# EAGLE design lmp9100 (EAGLE 7.2.0)
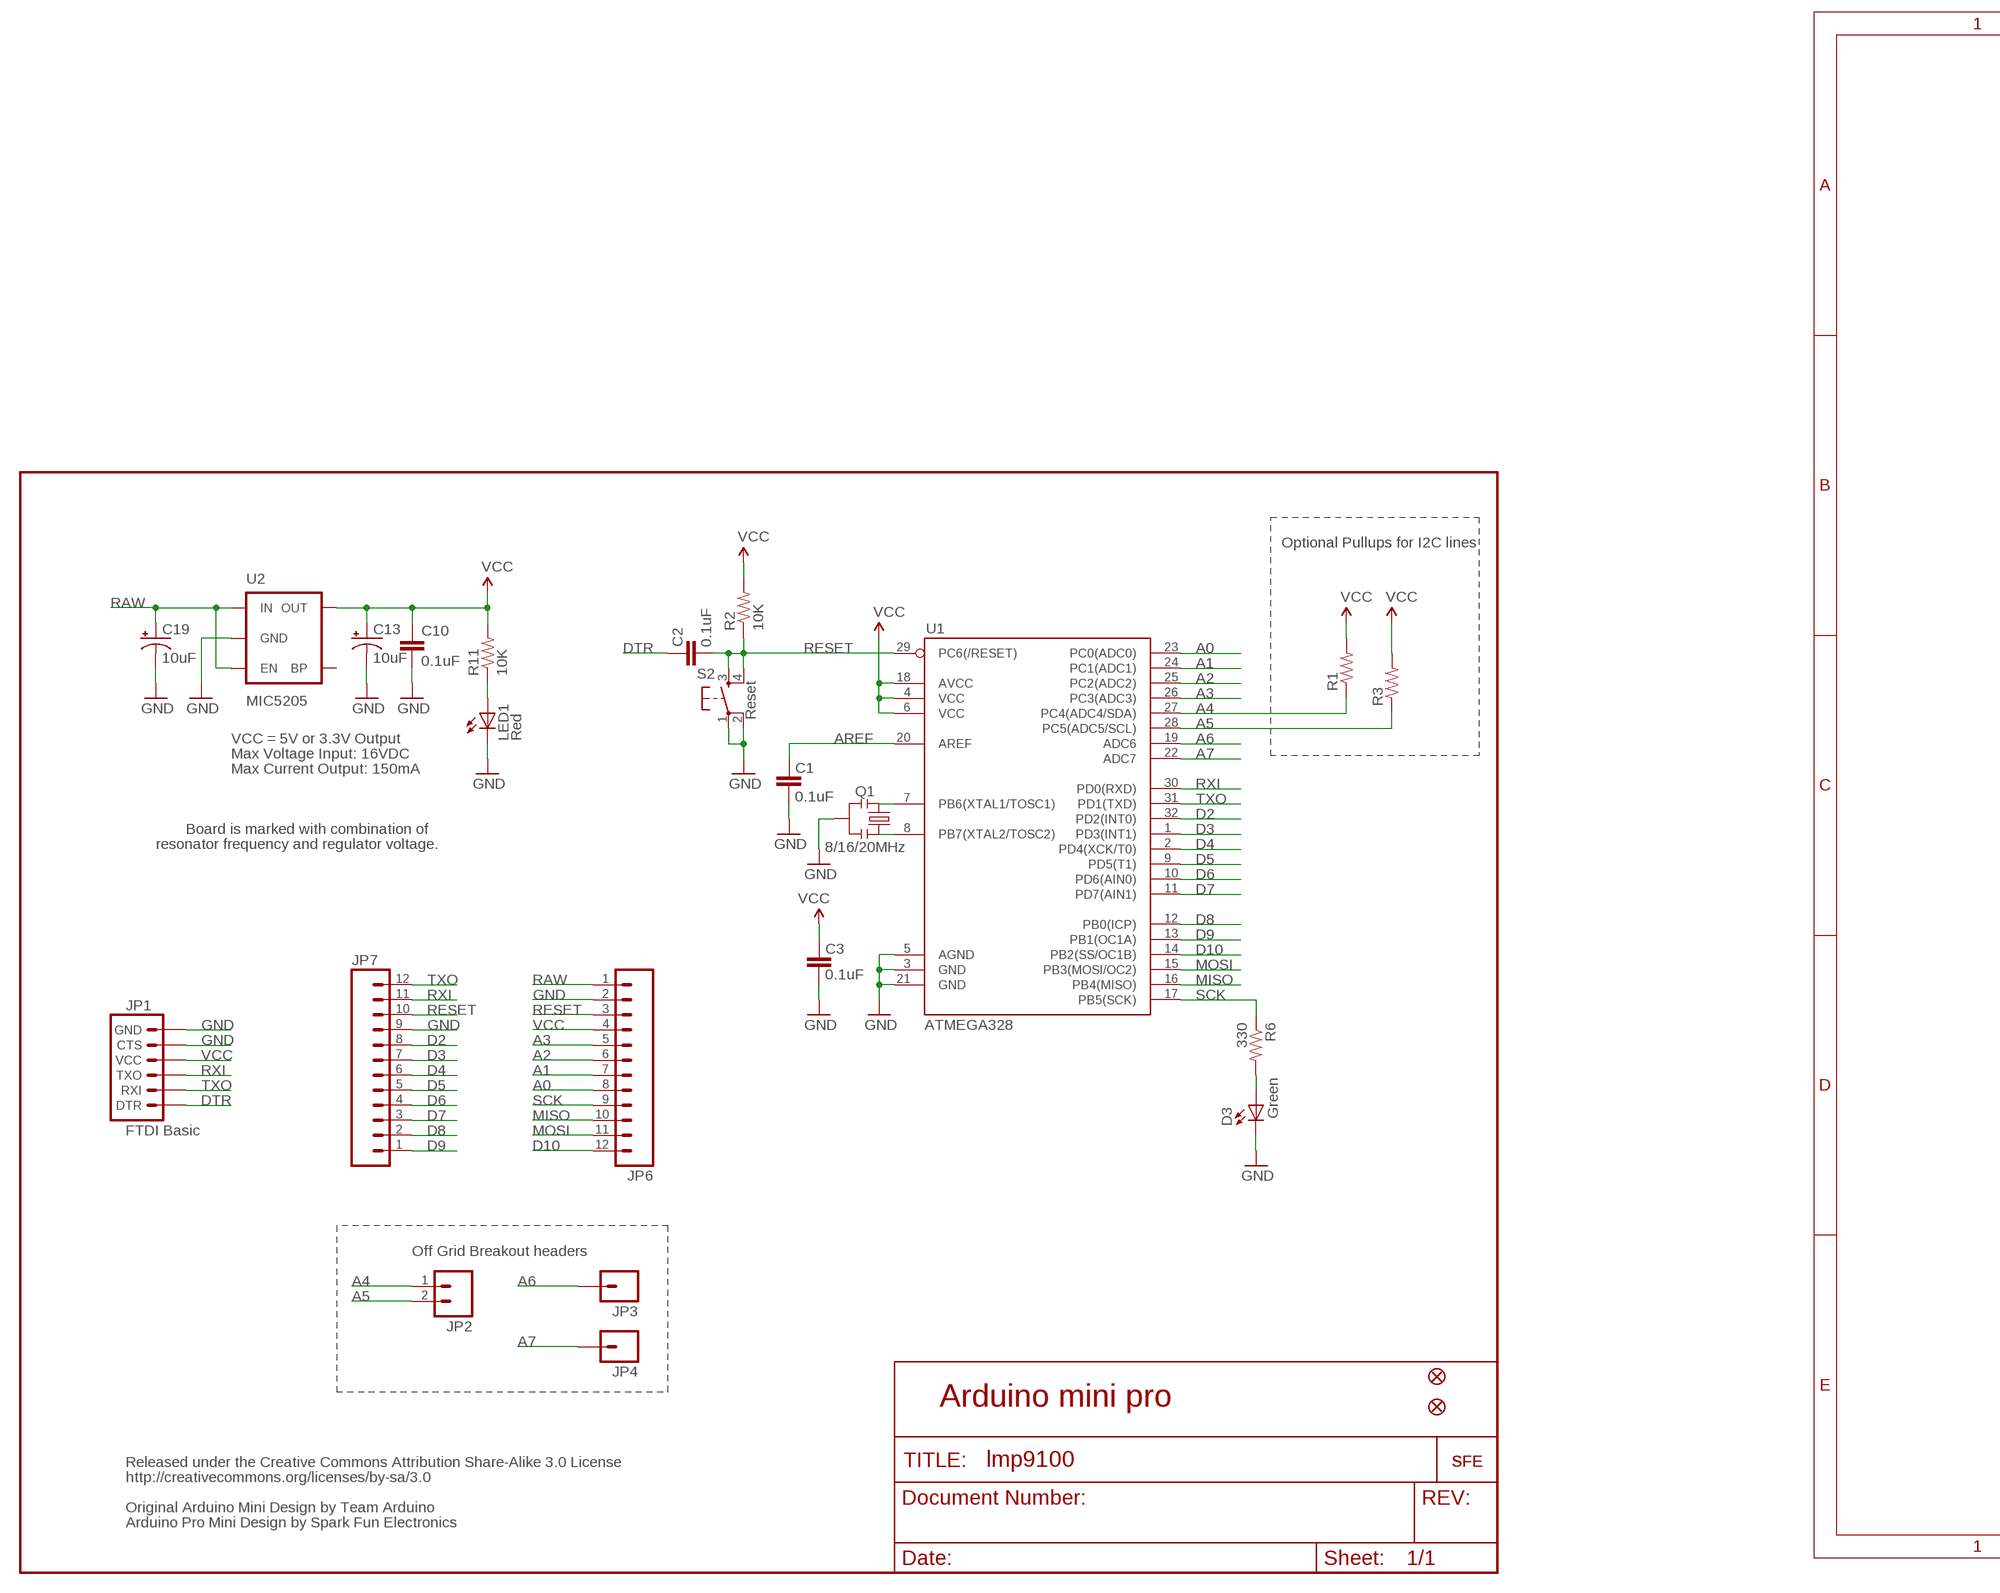
[diagram p0: schematic, sheet 1, part 1 of 2]
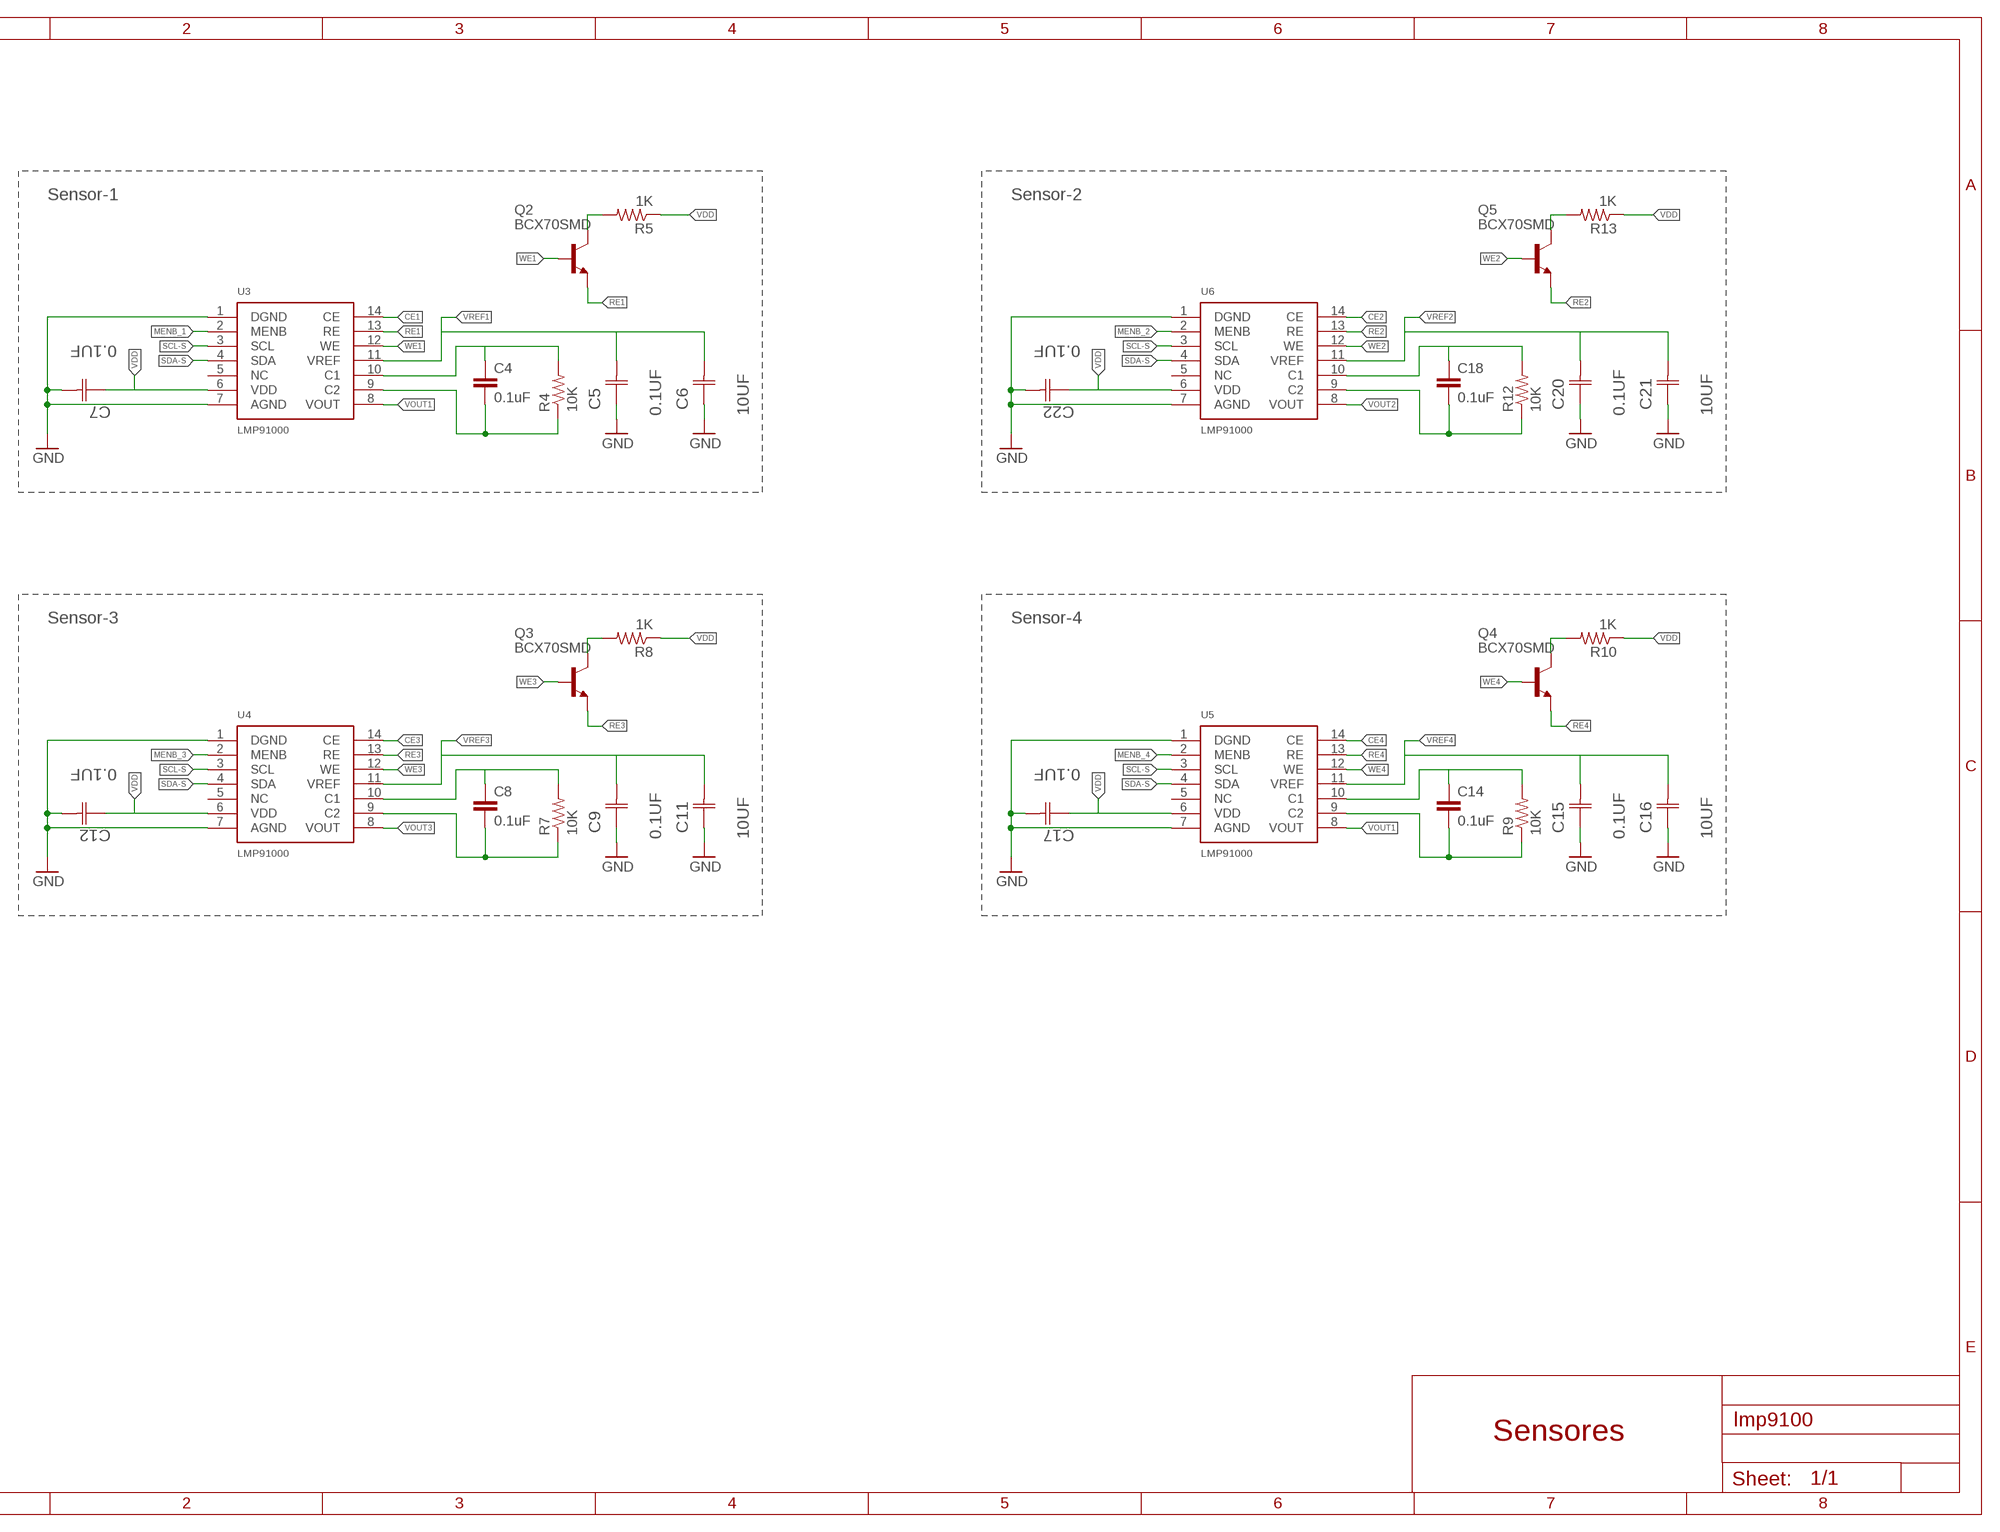
[diagram p1: schematic, sheet 1, part 2 of 2]

## Parts
C1  0.1uF  CAP0402-CAP  [0402-CAP]
C2  0.1uF  CAP0402-CAP  [0402-CAP]
C3  0.1uF  CAP0402-CAP  [0402-CAP]
C4  0.1uF  CAP0402-CAP  [0402-CAP]
C5  0.1UF  0603YC104KAT2A  [CAPC1608X90N]
C6  10UF  1206YD106MAT2A  [CAPC3216X178N]
C7  0.1UF  0603YC104KAT2A  [CAPC1608X90N]
C8  0.1uF  CAP0402-CAP  [0402-CAP]
C9  0.1UF  0603YC104KAT2A  [CAPC1608X90N]
C10  0.1uF  CAP0402-CAP  [0402-CAP]
C11  10UF  1206YD106MAT2A  [CAPC3216X178N]
C12  0.1UF  0603YC104KAT2A  [CAPC1608X90N]
C13  10uF  CAP_POL1206  [EIA3216]
C14  0.1uF  CAP0402-CAP  [0402-CAP]
C15  0.1UF  0603YC104KAT2A  [CAPC1608X90N]
C16  10UF  1206YD106MAT2A  [CAPC3216X178N]
C17  0.1UF  0603YC104KAT2A  [CAPC1608X90N]
C18  0.1uF  CAP0402-CAP  [0402-CAP]
C19  10uF  CAP_POL1206  [EIA3216]
C20  0.1UF  0603YC104KAT2A  [CAPC1608X90N]
C21  10UF  1206YD106MAT2A  [CAPC3216X178N]
C22  0.1UF  0603YC104KAT2A  [CAPC1608X90N]
D3  Green  LED0603  [LED-0603]
JP1  FTDI Basic  ARDUINO_SERIAL_PROGRAMPTH  [1X06]
JP2  M02PTH  [1X02]
JP3  M01PTH  [1X01]
JP4  M01PTH  [1X01]
JP5  FIDUCIALUFIDUCIAL  [MICRO-FIDUCIAL]
JP6  M12PTH  [1X12]
JP7  M12PTH  [1X12]
JP8  FIDUCIALUFIDUCIAL  [MICRO-FIDUCIAL]
LED1  Red  LED0603  [LED-0603]
Q1  8/16/20MHz  RESONATORSMD  [RESONATOR-SMD]
Q2  BCX70SMD  [SOT23]
Q3  BCX70SMD  [SOT23]
Q4  BCX70SMD  [SOT23]
Q5  BCX70SMD  [SOT23]
R1  RESISTOR0402-RES  [0402-RES]
R2  10K  RESISTOR0402-RES  [0402-RES]
R3  RESISTOR0402-RES  [0402-RES]
R4  10K  RESISTOR0402-RES  [0402-RES]
R5  1K  RESISTOR0402-RES  [0402-RES]
R6  330  RESISTOR0402-RES  [0402-RES]
R7  10K  RESISTOR0402-RES  [0402-RES]
R8  1K  RESISTOR0402-RES  [0402-RES]
R9  10K  RESISTOR0402-RES  [0402-RES]
R10  1K  RESISTOR0402-RES  [0402-RES]
R11  10K  RESISTOR0402-RES  [0402-RES]
R12  10K  RESISTOR0402-RES  [0402-RES]
R13  1K  RESISTOR0402-RES  [0402-RES]
S2  Reset  TAC_SWITCHSMD  [TACTILE_SWITCH_SMD]
U1  ATMEGA328  ATMEGA168  [TQFP32-08]
U2  MIC5205  V_REG_LDOSMD  [SOT23-5]
U3  LMP91000  [LMP91000]
U4  LMP91000  [LMP91000]
U5  LMP91000  [LMP91000]
U6  LMP91000  [LMP91000]
U$1  LOGO-SFESK  [SFE-LOGO-FLAME]
U$11  LOGO-SFENEW  [SFE-NEW-WEBLOGO]

## Nets
A0: JP6.8 U1.23(PC0(ADC0))
A1: JP6.7 U1.24(PC1(ADC1))
A2: JP6.6 U1.25(PC2(ADC2))
A3: JP6.5 U1.26(PC3(ADC3))
A4: JP2.1 R1.1 U1.27(PC4(ADC4/SDA))
A5: JP2.2 R3.1 U1.28(PC5(ADC5/SCL))
A6: JP3.1 U1.19(ADC6)
A7: JP4.1 U1.22(ADC7)
AREF: C1.2 U1.20(AREF)
CE1: U3.14(CE)
CE2: U6.14(CE)
CE3: U4.14(CE)
CE4: U5.14(CE)
D2: JP7.8 U1.32(PD2(INT0))
D3: JP7.7 U1.1(PD3(INT1))
D4: JP7.6 U1.2(PD4(XCK/T0))
D5: JP7.5 U1.9(PD5(T1))
D6: JP7.4 U1.10(PD6(AIN0))
D7: JP7.3 U1.11(PD7(AIN1))
D8: JP7.2 U1.12(PB0(ICP))
D9: JP7.1 U1.13(PB1(OC1A))
D10: JP6.12 U1.14(PB2(SS/OC1B))
DTR: C2.2 JP1.1(DTR)
GND [vcc]: C1.1 C3.1 C5.1(C1) C6.1(C1) C7.2(C2) C9.1(C1) C10.2 C11.1(C1) C12.2(C2) C13.C(-) C15.1(C1) C16.1(C1) C17.2(C2) C19.C(-) C20.1(C1) C21.1(C1) C22.2(C2) D3.C JP1.5(CTS) JP1.6(GND) JP6.2 JP7.9 LED1.C Q1.2 S2.1 S2.2 U1.3(GND) U1.5(AGND) U1.21(GND) U2.2(GND) U3.1(DGND) U3.7(AGND) U4.1(DGND) U4.7(AGND) U5.1(DGND) U5.7(AGND) U6.1(DGND) U6.7(AGND)
MENB_1: U3.2(MENB)
MENB_2: U6.2(MENB)
MENB_3: U4.2(MENB)
MENB_4: U5.2(MENB)
MISO: JP6.10 U1.16(PB4(MISO))
MOSI: JP6.11 U1.15(PB3(MOSI/OC2))
N$1: Q1.1 U1.8(PB7(XTAL2/TOSC2))
N$2: Q1.3 U1.7(PB6(XTAL1/TOSC1))
N$3: C4.2 R4.1 U3.9(C2)
N$4: C4.1 R4.2 U3.10(C1)
N$5: Q2.3(C) R5.2
N$6: C8.2 R7.1 U4.9(C2)
N$7: D3.A R6.2
N$8: C8.1 R7.2 U4.10(C1)
N$9: Q3.3(C) R8.2
N$10: C14.2 R9.1 U5.9(C2)
N$11: C14.1 R9.2 U5.10(C1)
N$12: Q4.3(C) R10.2
N$13: C18.2 R12.1 U6.9(C2)
N$14: C18.1 R12.2 U6.10(C1)
N$15: Q5.3(C) R13.2
N$38: LED1.A R11.1
RAW [vcc]: C19.A(+) JP6.1 U2.1(IN) U2.3(EN)
RE1: Q2.2(E) U3.13(RE)
RE2: Q5.2(E) U6.13(RE)
RE3: Q3.2(E) U4.13(RE)
RE4: Q4.2(E) U5.13(RE)
RESET: C2.1 JP6.3 JP7.10 R2.1 S2.3 S2.4 U1.29(PC6(/RESET))
RXI: JP1.3(TXO) JP7.11 U1.30(PD0(RXD))
SCK: JP6.9 R6.1 U1.17(PB5(SCK))
SCL-S: U3.3(SCL) U4.3(SCL) U5.3(SCL) U6.3(SCL)
SDA-S: U3.4(SDA) U4.4(SDA) U5.4(SDA) U6.4(SDA)
TXO: JP1.2(RXI) JP7.12 U1.31(PD1(TXD))
VCC: C3.2 C10.1 C13.A(+) JP1.4(VCC) JP6.4 R1.2 R2.2 R3.2 R11.2 U1.4(VCC) U1.6(VCC) U1.18(AVCC) U2.5(OUT)
VDD: C7.1(C1) C12.1(C1) C17.1(C1) C22.1(C1) R5.1 R8.1 R10.1 R13.1 U3.6(VDD) U4.6(VDD) U5.6(VDD) U6.6(VDD)
VOUT1: U3.8(VOUT) U5.8(VOUT)
VOUT2: U6.8(VOUT)
VOUT3: U4.8(VOUT)
VREF1: C5.2(C2) C6.2(C2) U3.11(VREF)
VREF2: C20.2(C2) C21.2(C2) U6.11(VREF)
VREF3: C9.2(C2) C11.2(C2) U4.11(VREF)
VREF4: C15.2(C2) C16.2(C2) U5.11(VREF)
WE1: Q2.1(B) U3.12(WE)
WE2: Q5.1(B) U6.12(WE)
WE3: Q3.1(B) U4.12(WE)
WE4: Q4.1(B) U5.12(WE)
Unconnected: U2.4(BP) U3.5(NC) U4.5(NC) U5.5(NC) U6.5(NC)

## Notes on the sheet
- Sensor-1 | Sensor-2
- Optional Pullups for I2C lines
- Sensor-3 | Sensor-4
- VCC = 5V or 3.3V Output
- Max Voltage Input: 16VDC
- Max Current Output: 150mA
- Board is marked with combination of
- resonator frequency and regulator voltage.
- Off Grid Breakout headers
- Arduino mini pro
- Released under the Creative Commons Attribution Share-Alike 3.0 License
- http://creativecommons.org/licenses/by-sa/3.0 | Sensores
- Original Arduino Mini Design by Team Arduino
- Arduino Pro Mini Design by Spark Fun Electronics

## Library data of the parts
C1-C4 C8 C10 C14 C18 = SparkFun:CAP: Capacitor Standard 0603 ceramic capacitor, and 0.1" leaded capacitor.
C5 C7 C9 C12 C15 C17 C20 C22 = AVX_By_element14_Batch_1:0603YC104KAT2A: Capacitor, 0603; MPN: 0603YC104KAT2A; OC_FARNELL: 1327679; OC_NEWARK: 96M1176; SUPPLIER: AVX; TOLERANCE: ±10%; VOLTAGERATING: 16V
C6 C11 C16 C21 = AVX_By_element14_Batch_1:1206YD106MAT2A: Capacitor 1206; MPN: 1206YD106MAT2A; OC_FARNELL: 1582746; OC_NEWARK: 96M1430; SUPPLIER: AVX; TOLERANCE: ±20%; VOLTAGERATING: 16V
C13 C19 = SparkFun:CAP_POL: Capacitor Polarized These are standard SMD and PTH capacitors. Normally 10uF, 47uF, and 100uF in electrolytic and tantalum varieties. Always verify the external diameter of the through hole cap, it varies with capacity, voltage, and manufacturer. The EIA devices should be standard.
D3 LED1 = SparkFun:LED: LEDs Standard schematic elements and footprints for 5mm, 3mm, 1206, and 0603 sized LEDs. 5mm - Spark Fun Electronics SKU : COM-00529 (and others)
JP1 = SparkFun:ARDUINO_SERIAL_PROGRAM
JP2 = SparkFun:M02: Header 2 Standard 2-pin 0.1" header. Use with straight break away headers (SKU : PRT-00116), right angle break away headers (PRT-00553), swiss pins (PRT-00743), machine pins (PRT-00117), and female headers (PRT-00115). Molex polarized connector foot print use with SKU : PRT-08233 with associated crimp pins and housings.
JP3 JP4 = SparkFun:M01: Header 1 Standard 1-pin 0.1" header. Use with straight break away headers (SKU : PRT-00116), right angle break away headers (PRT-00553), swiss pins (PRT-00743), machine pins (PRT-00117), and female headers (PRT-00115).
JP5 JP8 = SparkFun:FIDUCIAL: Fiducial Alignment Points Various fiducial points for machine vision alignment.
JP6 JP7 = SparkFun:M12: Header 12 Standard 12-pin 0.1" header. Use with straight break away headers (SKU : PRT-00116), right angle break away headers (PRT-00553), swiss pins (PRT-00743), machine pins (PRT-00117), and female headers (PRT-00115).
Q1 = SparkFun:RESONATOR: Resonator Small SMD resonator. This is the itty bitty 10/20MHz resonators with built in caps. CSTCE10M0G55 and CSTCE20M0V53. Footprint has been reviewed closely but hasn't been tested yet.
Q2-Q5 = transistor-npn:BCX70*: NPN Transistor
R1-R13 = SparkFun:RESISTOR: Resistor Basic schematic elements and footprints for 0603, 1206, and PTH resistors.
S2 = SparkFun:TAC_SWITCH: Momentary Switch Button commonly used for reset or general input. Spark Fun Electronics SKU : COM-00097
U1 = SparkFun:ATMEGA168
U2 = SparkFun:V_REG_LDO: Voltage Regulator LDO Standard 150mA LDO voltage regulator in SOT-23 layout. Micrel part MIC5205. BP (by-pass) pin is used to lower output noise with 470pF cap.
U3-U6 = lmp91000:LMP91000
U$1 U$11 = SparkFun:LOGO-SFE: Spark Fun Electronics PCB Logo This is the standard Spark Fun Electronics PCB logo.

## Net classes
0 default: width 0.203 mm
1 vcc: width 0.254 mm

## Board
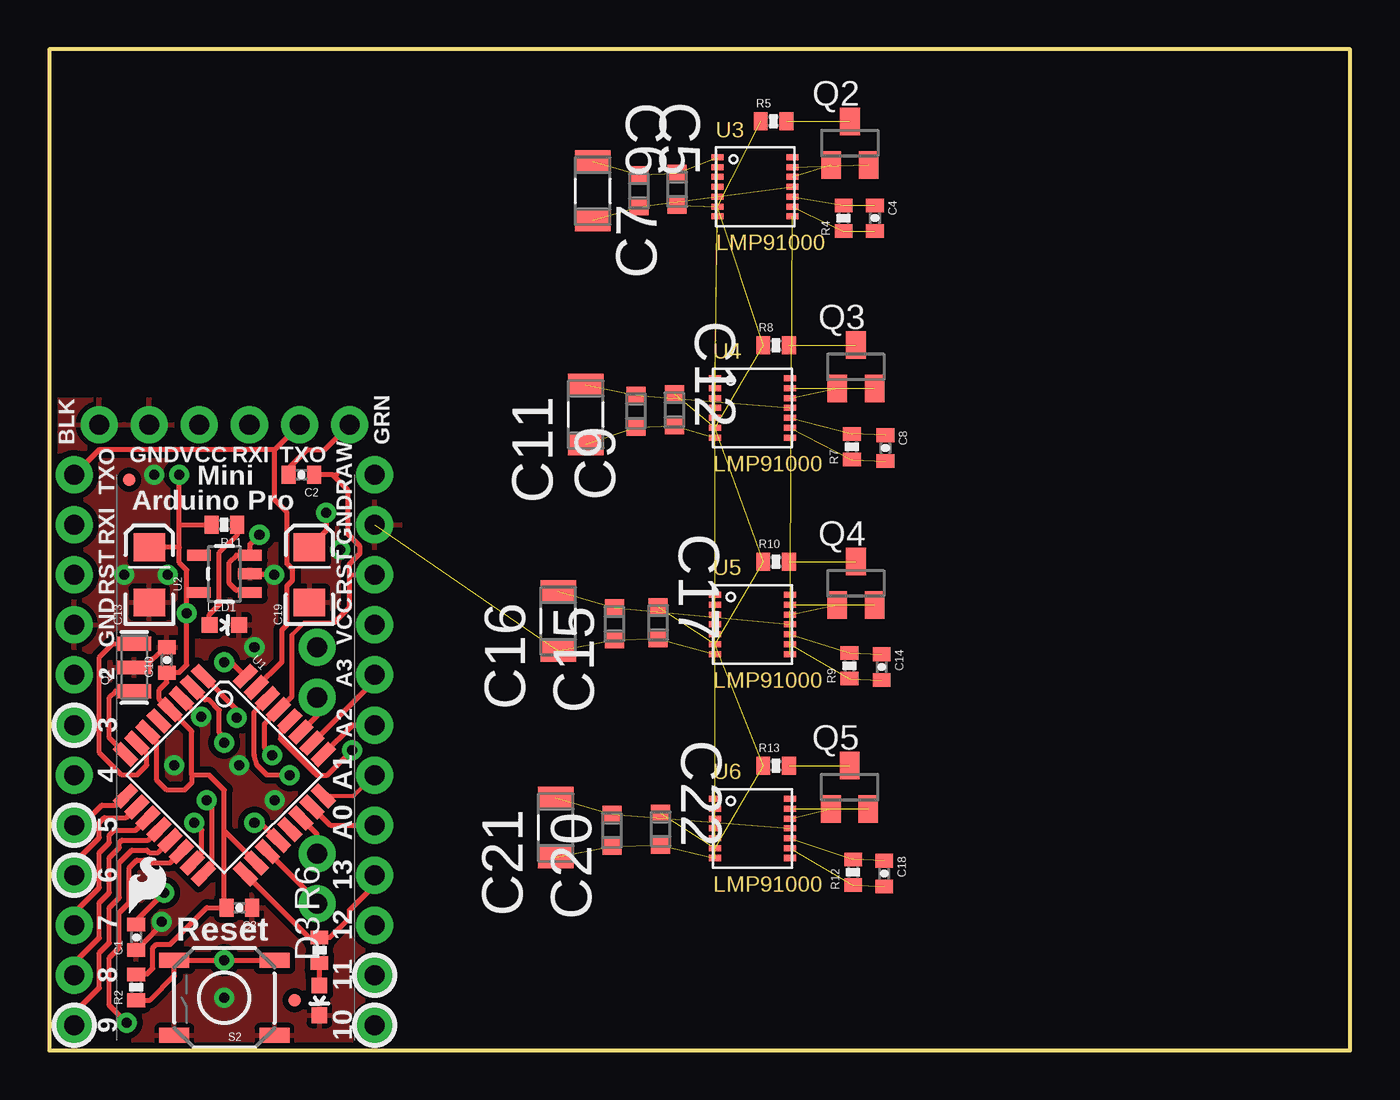
[diagram p2: board, top side]
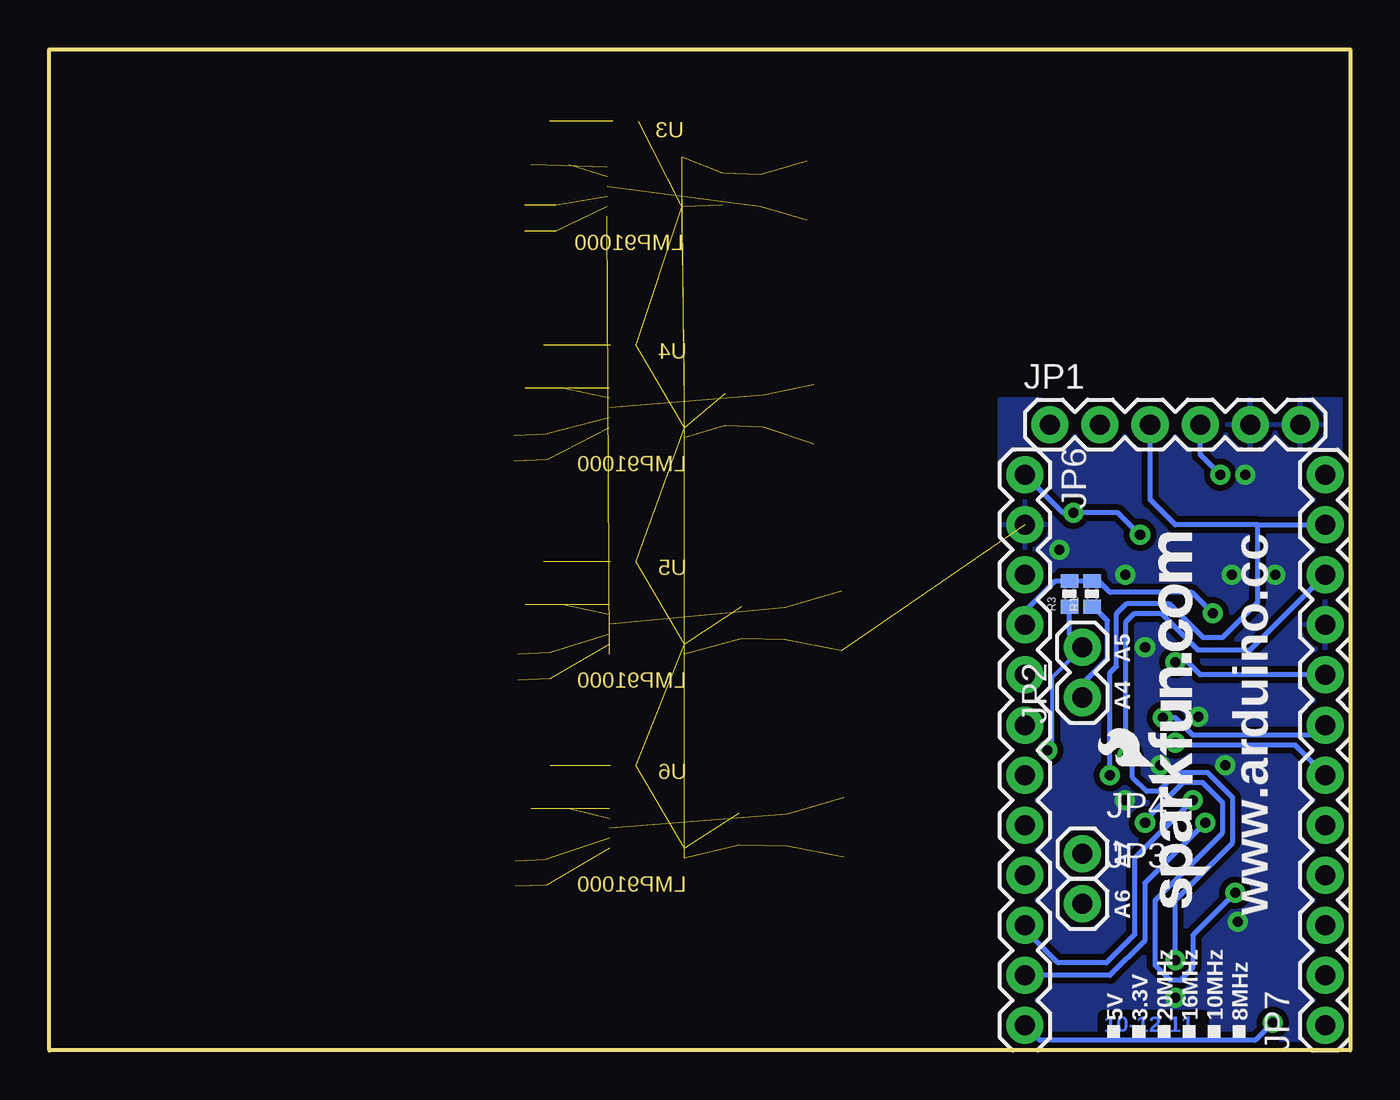
[diagram p3: board, bottom side, seen from below]

Size 66.04 x 50.8 mm. Coordinates in mm from the lower left corner, seen from the top.
Outline: 0,50.8 0,0 66.04,0 66.04,50.8 0,50.8
Copper layers (1*16): Top 0.035mm / dielectric 1.5mm / Bottom 0.035mm
Design rules "default": minimum track width 8mil, minimum drill 20mil, track to track 8mil, track to pad 8mil, pad to pad 8mil, via to via 8mil, smd to smd 8mil, copper to edge 8mil, drill to drill 8mil, minimum pad ring 12mil, minimum via ring 10mil, stop-mask expansion 4mil, vias tented up to drill 20mil, thermal gap 10mil

### Footprints (pad centres in the part's own frame; a part is rotated, then mirrored left to right if it is on the bottom)
0402-CAP = smd 0.7 x 0.9: 1 -0.65,0; 2 0.65,0
CAPC1608X90N = smd 0.864 x 0.965: 1 -0.813,0; 2 0.813,0
CAPC3216X178N = smd 1.118 x 1.803: 1 -1.499,0; 2 1.499,0
EIA3216 = smd 1.4 x 1.6: A 1.4,0; C -1.4,0
LED-0603 = smd 0.8 x 0.8: A 0,-0.75; C 0,0.75
1X06 = drill 1.016 pad 1.88: 1 0,0; 2 2.54,0; 3 5.08,0; 4 7.62,0; 5 10.16,0; 6 12.7,0
1X02 = drill 1.016 pad 1.88: 1 0,0; 2 2.54,0
1X01 = drill 1.016 pad 1.88: 1 0,0
MICRO-FIDUCIAL = smd 0.635 x 0.635: 1 0,0
1X12 = drill 1.016 pad 1.88: 1 0,0; 2 2.54,0; 3 5.08,0; 4 7.62,0; 5 10.16,0; 6 12.7,0; 7 15.24,0; 8 17.78,0; 9 20.32,0; 10 22.86,0; 11 25.4,0; 12 27.94,0
RESONATOR-SMD = smd 0.7 x 1.7: 1 -1.2,0; 2 0,0; 3 1.2,0
SOT23 = smd 1 x 1.4: 1 -0.95,-1.1; 2 0.95,-1.1; 3 0,1.1
0402-RES = smd 0.7 x 0.9: 1 -0.65,0; 2 0.65,0
TACTILE_SWITCH_SMD = smd 1.524 x 0.762: 1 -2.54,1.905; 2 2.54,1.905; 3 -2.54,-1.905; 4 2.54,-1.905
TQFP32-08 = smd 1.27 x 0.559: 1 -4.293,2.8; 2 -4.293,2; 3 -4.293,1.2; 4 -4.293,0.4; 5 -4.293,-0.4; 6 -4.293,-1.2; 7 -4.293,-2; 8 -4.293,-2.8; 17 4.293,-2.8; 18 4.293,-2; 19 4.293,-1.2; 20 4.293,-0.4; 21 4.293,0.4; 22 4.293,1.2; 23 4.293,2; 24 4.293,2.8 | smd 0.559 x 1.27: 9 -2.8,-4.293; 10 -2,-4.293; 11 -1.2,-4.293; 12 -0.4,-4.293; 13 0.4,-4.293; 14 1.2,-4.293; 15 2,-4.293; 16 2.8,-4.293; 25 2.8,4.293; 26 2,4.293; 27 1.2,4.293; 28 0.4,4.293; 29 -0.4,4.293; 30 -1.2,4.293; 31 -2,4.293; 32 -2.8,4.293
SOT23-5 = smd 0.55 x 1.2: 1 -0.95,-1.3; 2 0,-1.3; 3 0.95,-1.3; 4 0.95,1.3; 5 -0.95,1.3
LMP91000 = smd 0.61 x 0.305: 1 0.1,3.5; 2 0.1,3; 3 0.1,2.5; 4 0.1,2; 5 0.1,1.5; 6 0.1,1; 7 0.1,0.5; 8 3.9,0.5; 9 3.9,1; 10 3.9,1.5; 11 3.9,2; 12 3.9,2.5; 13 3.9,3; 14 3.9,3.5

### Placement (x,y rotation side)
C1  4.42,5.74 90 top
C2  12.8,29.21 180 top
C3  9.65,7.24 180 top
C4  41.91,42.23 270 top
C5  29.93,43.62 270 top
C6  27.59,43.62 270 top
C7  31.88,43.7 90 top
C8  42.44,30.56 270 top
C9  29.77,32.44 90 top
C10  5.97,19.81 90 top
C11  27.23,32.27 90 top
C12  31.73,32.5 270 top
C13  5.08,24.13 90 top
C14  42.25,19.44 270 top
C15  28.69,21.64 90 top
C16  25.84,21.79 90 top
C17  30.9,21.71 270 top
C18  42.38,8.97 270 top
C19  13.21,24.13 90 top
C20  28.57,11.16 90 top
C21  25.71,11.31 90 top
C22  31.03,11.23 270 top
D3  13.72,2.54 180 top
JP1  15.24,31.75 0 bottom
JP2  13.59,17.91 90 bottom
JP3  13.59,7.44 0 bottom
JP4  13.59,9.98 0 bottom
JP5  4.06,28.96 0 top
JP6  16.51,29.21 270 bottom
JP7  1.27,1.27 90 bottom
JP8  12.45,2.54 0 top
LED1  8.89,21.59 270 top
Q1  4.32,19.43 90 top
Q2  40.64,46.04 0 top
Q3  40.94,34.69 0 top
Q4  40.94,23.7 0 top
Q5  40.63,13.35 0 top
R1  13.11,23.16 90 bottom
R2  4.42,3.2 90 top
R3  14.25,23.16 90 bottom
R4  40.32,42.23 90 top
R5  36.77,47.15 0 top
R6  13.72,5.08 270 top
R7  40.74,30.63 90 top
R8  36.89,35.78 0 top
R9  40.61,19.52 90 top
R10  36.89,24.79 0 top
R11  8.89,26.67 180 top
R12  40.81,9.04 90 top
R13  36.89,14.44 0 top
S2  8.89,2.67 180 top
U1  8.89,13.97 315 top
U2  8.89,24.18 90 top
U3  33.83,41.82 0 top
U4  33.69,30.6 0 top
U5  33.69,19.61 0 top
U6  33.69,9.26 0 top
U$1  4.06,6.99 0 top
U$11  7.11,7.24 90 bottom

### Tracks (layer width: path | path; a pad name or v marks a point on that pad's centre or on a via)
A0
  Top 0.254: U1.23 14.26,11.43 JP6.8
A1
  Top 0.203: U1.24 15.45,12.91 JP6.7
A2
  Top 0.254: U1.25 15.39,16.51 JP6.6
A3
  Top 0.254: U1.26 16.51,18.76 JP6.5
A4
  Top 0.254: U1.27 13.59,16.97 JP2.1
  Bottom 0.254: JP2.1 13.59,18.59 12.32,19.86 12.32,21.8 13.03,22.52 R1.1
A5  (via drill 0.51)
  Top 0.254: v15.37,15.24 14.1,13.97 13.59,13.97 13.46,14.1 13.44,14.1 11.73,15.8 11.73,16.25 U1.28
  Bottom 0.203: v15.37,15.24 15.11,15.49 15.11,18.92 JP2.2
  Bottom 0.254: R3.1 14.25,21.11 JP2.2
A6
  Top 0.254: U1.19 13.59,7.57 JP3.1
A7
  Top 0.254: U1.22 13.59,10.97 JP4.1
AREF  (via drill 0.51)
  Top 0.254: v5.84,8 4.42,6.58 C1.2 | U1.20 10.74,11.56 v10.41,11.56
  Bottom 0.254: v10.41,11.56 10.41,11.68 8.51,13.59 7.49,13.59 6.48,12.57 6.48,11.05 9.91,7.62 9.91,4.32 9.14,3.56 8.64,3.56 8,4.19 8,5.84 v5.84,8
D2  (via drill 0.51)
  Top 0.254: U1.32 9.25,19.68 v8.89,19.68
  Bottom 0.254: JP7.8 7.62,19.05 8.26,19.68 v8.89,19.68
D3  (via drill 0.51)
  Top 0.254: U1.1 9.53,17.3 v9.53,16.89
  Bottom 0.254: JP7.7 1.78,16 8,16 8.89,16.89 v9.53,16.89
D4  (via drill 0.51)
  Top 0.254: v8.89,15.62 9.14,15.62 8.64,16.13 8.64,17.27 8.13,17.78 7.91,17.78 U1.2
  Bottom 0.254: JP7.6 2.79,15.49 8.76,15.49 v8.89,15.62
D5
  Top 0.254: U1.9 3.41,12.45 2.67,12.45 1.65,11.43 JP7.5
D6
  Top 0.254: 1.27,9.18 JP7.4 1.27,9.53 2.54,10.79 2.54,11.56 2.79,11.81 3.9,11.81 U1.10
D7
  Top 0.254: JP7.3 1.27,6.99 2.54,8.26 2.54,10.03 3.05,10.54 3.05,10.92 3.3,11.18 4.4,11.18 U1.11
D8
  Top 0.254: JP7.2 1.27,4.45 2.54,5.71 2.54,7.49 3.05,8 3.05,9.78 3.56,10.29 3.56,10.54 3.68,10.67 5.02,10.67 U1.12
D9
  Top 0.254: U1.13 5.52,10.03 5.08,10.03 4.95,10.16 4.19,10.16 3.56,9.53 3.56,7.75 3.05,7.24 3.05,5.46 2.54,4.95 2.54,3.17 1.27,1.91 JP7.1
D10  (via drill 0.51)
  Top 0.254: U1.14 6.14,9.53 4.95,9.53 4.83,9.65 4.45,9.65 4.06,9.27 4.06,7.49 3.56,6.99 3.56,5.21 3.05,4.7 3.05,2.29 v3.94,1.4
  Bottom 0.254: JP6.12 15.75,0.51 4.83,0.51 v3.94,1.4
DTR
  Top 0.254: JP1.1 13.97,30.48 13.08,30.48 12.15,29.55 C2.2
GND  (via drill 0.51)  (20 unrouted)
  Top 0.254: U1.3 7.62,16.94 | C10.2 5.86,20.46 4.83,19.43 Q1.2 | C1.1 5.71,6.39 v5.71,6.53 | v11.4,24.13 10.16,24.13
  other vias: 11.43,12.7 9.65,14.48 8.89,2.67 5.33,29.21 10.41,20.45 6.35,14.48 14.76,25.4 7.72,16.94 3.81,24.13 6.02,24.13
  pour Top (isolate 0.305): 0,33.02 17.78,33.02 17.78,0 0,0
  pour Bottom (isolate 0.305): 0,33.02 17.78,33.02 17.78,0 0,0
MISO  (via drill 0.51)
  Top 0.254: U1.16 8.26,9.38 8.26,12.45 v8,12.7
  Bottom 0.254: v8,12.7 10.92,9.78 10.92,5.89 12.37,4.45 14.83,4.45 16.51,6.12 JP6.10
MOSI  (via drill 0.51)
  Top 0.254: U1.15 7.75,10 7.75,11.18 v7.37,11.56
  Bottom 0.254: v7.37,11.56 10.44,8.48 10.44,5.56 12.19,3.81 JP6.11
N$1
  Top 0.254: U1.8 3.05,15.85 3.05,17.91 3.37,18.23 Q1.1
N$2
  Top 0.254: Q1.3 3.23,20.63 2.54,19.94 2.54,15.11 3.68,13.97 4.45,13.97 4.95,14.48 4.95,15.08 U1.7
N$3  (2 unrouted)
N$4  (2 unrouted)
N$5  (1 unrouted)
N$6  (2 unrouted)
N$7
  Top 0.254: D3.A R6.2
N$8  (2 unrouted)
N$9  (1 unrouted)
N$10  (2 unrouted)
N$11  (2 unrouted)
N$12  (1 unrouted)
N$13  (2 unrouted)
N$14  (2 unrouted)
N$15  (1 unrouted)
N$38
  Top 0.254: R11.1 9.54,26.18 8.64,25.27 8.64,22.61 8.13,22.1 8.13,21.59 LED1.A
RAW  (via drill 0.51)
  Top 0.254: v10.67,26.16 10.19,25.68 U2.3 9.51,25.13 9.14,24.77 9.14,23.7 9.5,23.34 10.08,23.34 U2.1 | C19.A 14.05,26.37 v14.05,27.28
  Bottom 0.254: v10.67,26.16 11.79,27.28 v14.05,27.28 14.58,27.28 JP6.1
RE1  (1 unrouted)
RE2  (1 unrouted)
RE3  (1 unrouted)
RE4  (1 unrouted)
RESET  (via drill 0.51)
  Top 0.203: 14.48,21.72 12.95,21.72 12.32,21.08
  Top 0.254: S2.3 v8.89,4.57 S2.4 6.35,3.79 5.12,2.55 R2.1 | 14.38,29.21 C2.1 | 14.38,29.21 14.61,29.21 | 15.24,24.13 JP6.3 | 12.32,21.08 12.32,17.96 U1.29 10.92,16.57 10.92,15.37 v11.3,14.99 | 15.24,24.13 15.24,22.48 14.48,21.72 | 15.24,24.13 15.24,24.69 15.77,25.22 15.77,25.58 15.16,26.19 15.16,28.42 14.38,29.21
  Bottom 0.254: v8.89,4.57 8.89,7.62 5.97,10.54 5.97,12.83 7.24,14.1 8.76,14.1 9.72,13.14 10.35,13.14 11.05,13.84 11.05,14.73 v11.3,14.99 11.38,15.06 11.38,21.74 10.95,22.17 9.6,22.17 7.75,20.32 5.08,20.32 JP7.10
RXI  (via drill 0.51)
  Top 0.254: U1.30 10.41,17.19 10.41,14.99 10.54,14.48 11.05,13.97 v12.19,13.97
  Bottom 0.254: 4.7,26.67 JP7.11 | 4.7,26.67 8.89,26.67 10.16,27.94 JP1.3 | v12.19,13.97 12.19,19.15 11.86,19.48 11.86,22.15 11.33,22.68 9.22,22.68 7.49,20.95 6.48,20.95 4.7,22.73 4.7,26.67
SCK
  Top 0.254: JP6.9 16.51,8.38 15.24,7.11 15.24,6.73 14.24,5.73 R6.1 13.17,5.73 U1.17
SCL-S  (3 unrouted)
SDA-S  (3 unrouted)
TXO
  Top 0.254: JP7.12 2.54,30.48 11.43,30.48 | 11.43,30.48 11.43,27.94 12.06,27.3 12.06,24.69 12.34,24.41 12.34,23.85 12.06,23.57 12.06,21.59 11.81,21.34 11.81,19.72 U1.31 | 11.43,30.48 JP1.2
VCC  (via drill 0.51)
  Top 0.254: C13.A 6.6,25.53 | 8.94,11.1 U1.18 | 8.94,11.1 8.89,11.14 | 8.89,11.05 8.94,11.1 | 8.89,11.05 8.89,13.21 8.13,13.97 7.24,13.97 | 6.11,17.29 6.1,17.27 | 6.11,17.29 U1.4 7.24,16.19 7.24,13.97 | 6.11,17.29 5.59,17.81 5.59,18.29 5.97,18.67 C10.1 5.95,19.16 5.97,19.18 6.6,19.18 6.99,19.56 v6.99,22.17 6.99,23.23 | 6.6,25.53 6.6,24.75 6.99,24.37 6.99,23.23 | 6.6,26.67 v6.6,29.21 | 6.6,25.53 6.6,26.67 | 6.6,26.67 R11.2 | 7.24,13.97 7.24,13.59 6.86,13.21 5.97,13.21 5.46,13.72 5.46,15.7 U1.6 | C3.2 9,7.51 | C3.2 8,7.24 6.15,5.38 5.44,5.38 5.26,5.21 5.26,4.17 4.98,3.89 4.46,3.89 R2.2 | 8.89,11.05 8.89,7.24 C3.2 | 6.99,23.23 U2.5
  Bottom 0.254: 6.99,21.97 v6.99,22.17 8.05,23.24 12.19,23.24 12.77,23.82 R1.2 R3.2 14.26,23.8 14.99,23.8 16.51,22.28 JP6.4 | JP1.4 7.62,30.23 v6.6,29.21
VDD  (11 unrouted)
VOUT1  (1 unrouted)
VREF1  (2 unrouted)
VREF2  (2 unrouted)
VREF3  (2 unrouted)
VREF4  (2 unrouted)
WE1  (1 unrouted)
WE2  (1 unrouted)
WE3  (1 unrouted)
WE4  (1 unrouted)

### Text on the board
Bottom: 10-12-11
tPlace: BLK | GRN | GND | VCC | RXI | TXO | Mini | TXO | RAW | Arduino Pro | RXI | GND | RST | RST | VCC | GND | 2 | A3 | 3 | A2 | 4 | A1 | 5 | A0 | 6 | 13 | 7 | Reset | 12 | 8 | 11 | 9 | 10
bPlace: A5 | A4 | A7 | www.arduino.cc | A6 | 8MHz | 10MHz | 16MHz | 20MHz | 3.3V | 5V
tValues: Valid combinations: | 168V / 3.3V Reg / 8MHz | 168 / 5V Reg / 16MHz | 168 / 5V Reg / 20MHz | Mark back accordingly | Arduino Pro Mini